# EAGLE design BluetoothJsoknitPIDv0.1 (EAGLE 6.1)
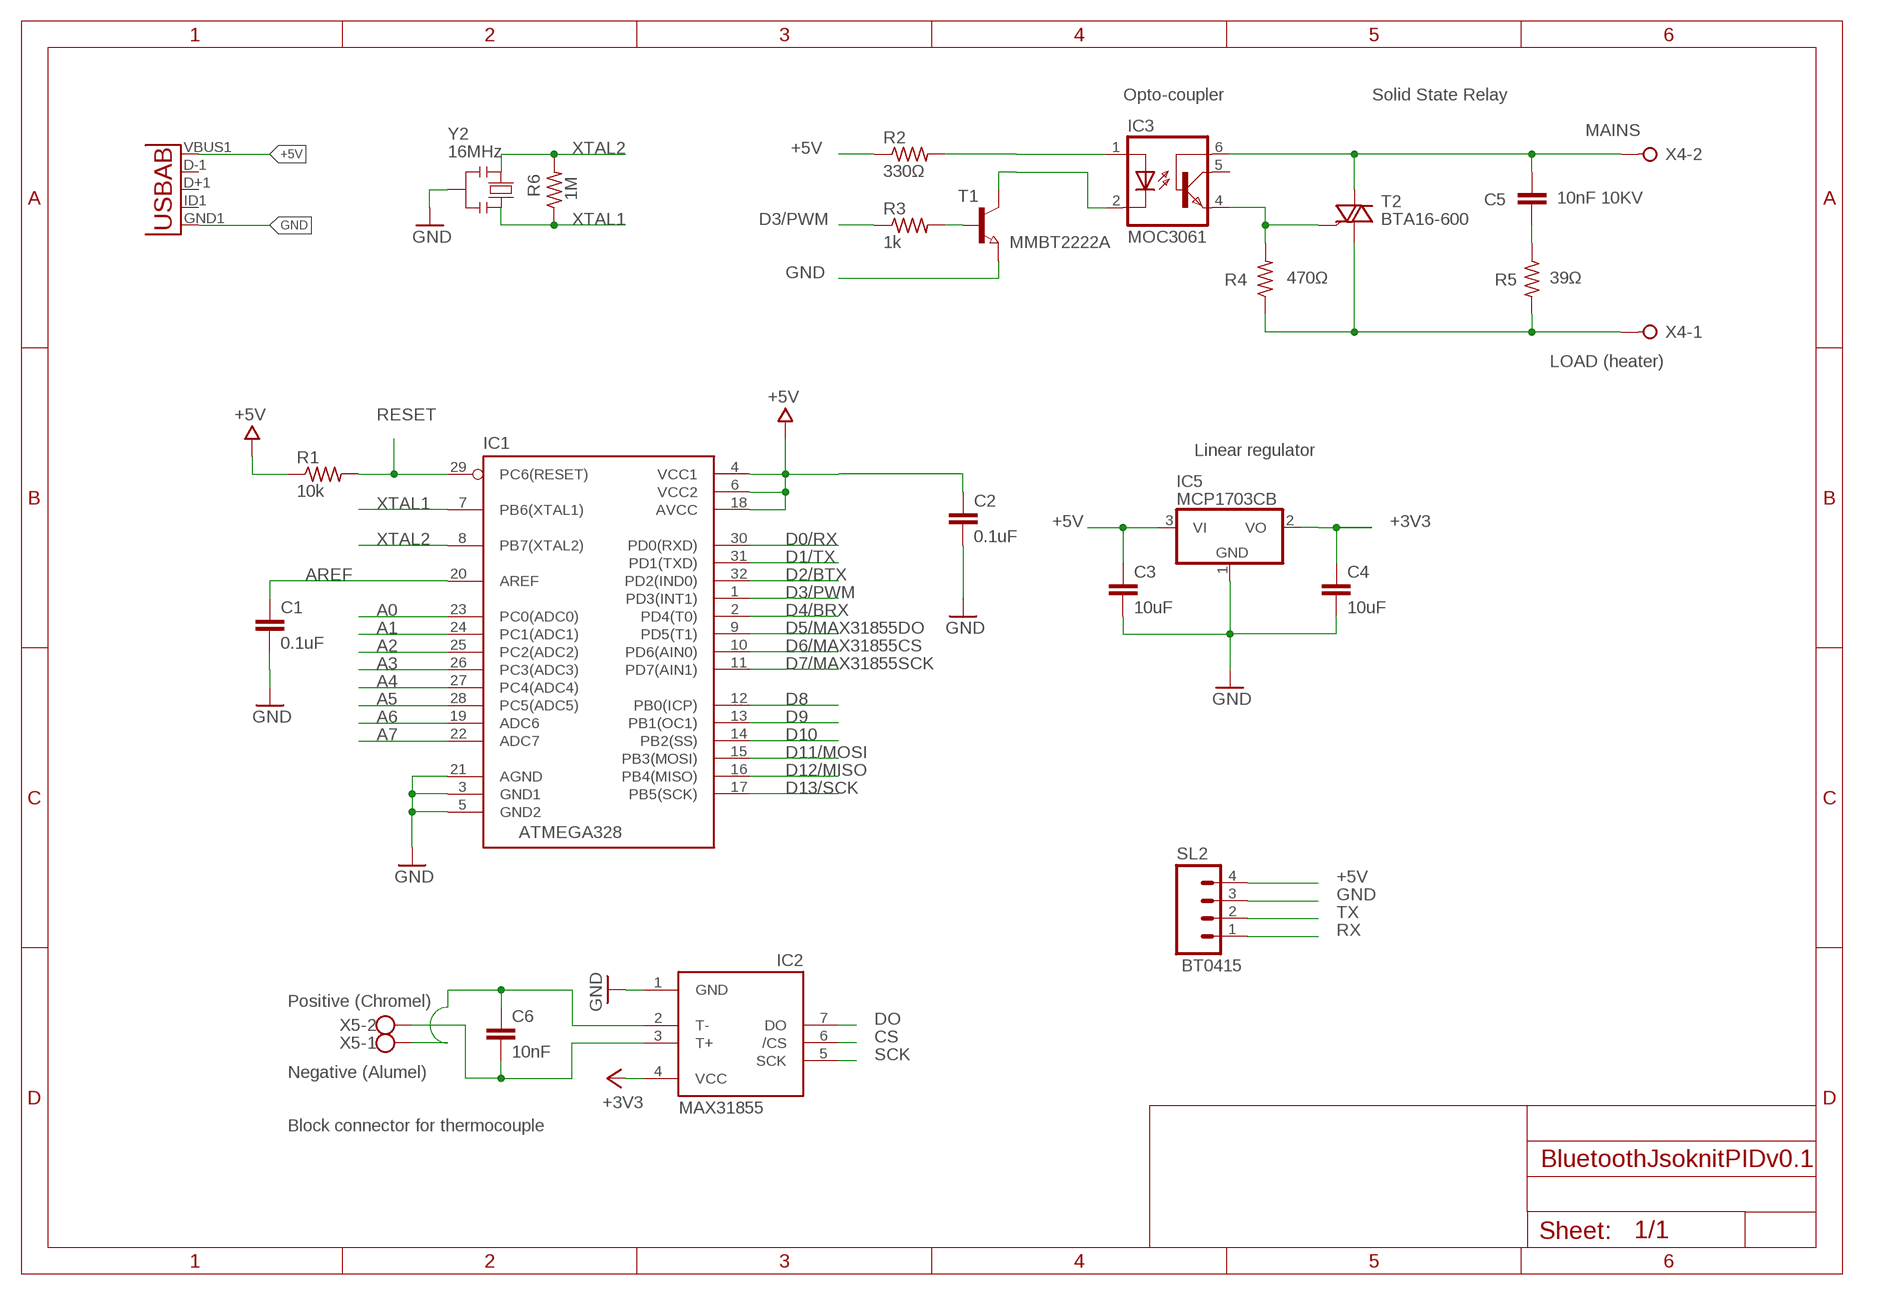
[diagram p0: schematic, sheet 1]

## Parts
C1  0.1uF  C-EUC0805  [C0805]
C2  0.1uF  C-EUC0805  [C0805]
C3  10uF  C-EUC0805  [C0805]
C4  10uF  C-EUC0805  [C0805]
C5  10nF 10KV  C-EU050-025X075  [C050-025X075]
C6  10nF  C-EUC0805  [C0805]
IC1  ATMEGA328  ATMEGA168-20AU  [QFP032]
IC2  MAX6675  [SO08]
IC3  MOC3061  4N25SM  [DIL6-SMD]
IC5  MCP1703CB  [SOT23]
R1  10k  R-US_M0805  [M0805]
R2  330Ω  R-US_M0805  [M0805]
R3  1k  R-US_M0805  [M0805]
R4  470Ω  R-US_0207/10  [0207/10]
R5  39Ω  R-US_0207/10  [0207/10]
R6  1M  R-US_M0805  [M0805]
SL2  BT0415  M04  [04P]
T1  MMBT2222A  NPN-TRANSISTOR_SOT23  [SOT23]
T2  BTA16-600  BT138-V  [TO220BV]
U$4  USB-AB""  [USB-AB-MICRO-SMD_V02_BOSS]
X4  W237-02P  [W237-132]
X5  W237-102  [W237-102]
Y2  16MHz  RESONATORMU  [RESONATOR]

## Nets
+3V3: C4.1 IC2.4(VCC) IC5.2(VO)
+5V: C2.1 C3.1 IC1.4(VCC1) IC1.6(VCC2) IC1.18(AVCC) IC5.3(VI) R1.1 R2.1 SL2.4 U$4.VBUS1(VBUS)
A0: IC1.23(PC0(ADC0))
A1: IC1.24(PC1(ADC1))
A2: IC1.25(PC2(ADC2))
A3: IC1.26(PC3(ADC3))
A4: IC1.27(PC4(ADC4))
A5: IC1.28(PC5(ADC5))
A6: IC1.19(ADC6)
A7: IC1.22(ADC7)
AREF: C1.1 IC1.20(AREF)
D0/RX: IC1.30(PD0(RXD))
D1/TX: IC1.31(PD1(TXD))
D2/BTX: IC1.32(PD2(IND0)) SL2.2
D3/PWM: IC1.1(PD3(INT1)) R3.1
D4/BRX: IC1.2(PD4(T0)) SL2.1
D5/MAX31855DO: IC1.9(PD5(T1)) IC2.7(DO)
D6/MAX31855CS: IC1.10(PD6(AIN0)) IC2.6(/CS)
D7/MAX31855SCK: IC1.11(PD7(AIN1)) IC2.5(SCK)
D8: IC1.12(PB0(ICP))
D9: IC1.13(PB1(OC1))
D10: IC1.14(PB2(SS))
D11/MOSI: IC1.15(PB3(MOSI))
D12/MISO: IC1.16(PB4(MISO))
D13/SCK: IC1.17(PB5(SCK))
GND [Power]: C1.2 C2.2 C3.2 C4.2 IC1.3(GND1) IC1.5(GND2) IC1.21(AGND) IC2.1(GND) IC5.1(GND) SL2.3 T1.2(E) U$4.GND1(GND) Y2.2
LOAD [Power]: R4.1 R5.2 T2.T1(A1) X4.1
MAINS: C5.1 IC3.6(BAS) T2.T2(A2) X4.2
MOC3061PIN4: IC3.4(EMI) R4.2 T2.G
N$9: IC3.2(C) T1.3(C)
N$10: R3.2 T1.1(B)
N$11: IC3.1(A) R2.2
N$14: C5.2 R5.1
RESET: IC1.29(PC6(RESET)) R1.2
T+: C6.2 IC2.3(T+) X5.2
T-: C6.1 IC2.2(T-)
T-1: X5.1
XTAL1: IC1.7(PB6(XTAL1)) R6.1 Y2.3
XTAL2: IC1.8(PB7(XTAL2)) R6.2 Y2.1
Unconnected: IC3.5(COL) U$4.D+1(D+) U$4.D-1(D-) U$4.ID1(USBID)

## Notes on the sheet
- Opto-coupler | Solid State Relay
- MAINS
- +5V
- D3/PWM
- GND
- LOAD (heater)
- RESET
- Linear regulator
- XTAL1
- +5V | +3V3
- XTAL2
- +5V
- GND
- TX
- RX
- Positive (Chromel)
- DO
- CS
- SCK
- Negative (Alumel)
- MAX31855
- Block connector for thermocouple

## Library data of the parts
C1-C6 = rcl:C-EU: CAPACITOR, European symbol
IC1 = MySMD:ATMEGA168-20AU
IC2 = adafruit:MAX6675
IC3 = optocoupler:4N*?M: General Purpose 6-Pin Phototransistor Optocouplers Source: http://www.fairchildsemi.com/ds/4N/4N35-M.pdf; MF: FAIRCHILD SEMICONDUCTOR; MPN: 4N25SM; OC_FARNELL: 1021152; OC_NEWARK: 34C2020
IC5 = linear:MCP1703: 250 mA, 16V, Low Quiescent Current LDO Regulator Source: http://ww1.microchip.com/downloads/en/DeviceDoc/22049b.pdf
R1-R6 = rcl:R-US_: RESISTOR, American symbol
SL2 = con-amp-quick:M04: AMP QUICK CONNECTOR; OC_FARNELL: unknown; OC_NEWARK: unknown
T1 = semicon-smd-ipc:NPN-TRANSISTOR_: NPN TRANSISTOR
T2 = triac:BT138: TRIAC Source: http://www.semiconductors.philips.com BT138_SERIES_2.pdf
U$4 = Testing:USB-AB: This is a USB AB connector that is compatible with USB OTG. i.e. this connector can serve as a host or device
X4 = con-wago-508:W237-02P: WAGO SREW CLAMP; OC_FARNELL: unknown; OC_NEWARK: unknown
X5 = con-wago-500:W237-102: WAGO SCREW CLAMP; MPN: 237-102; OC_FARNELL: unknown; OC_NEWARK: 70K9898
Y2 = SmartPrj:RESONATOR

## Net classes
0 default: width 0.152 mm, clearance 0.152 mm
1 Power: width 0.406 mm, drill 0.61 mm, clearance 0.152 mm
2 gnd: width 0.203 mm, drill 0.559 mm, clearance 0.152 mm
3 usbvcc: width 0.203 mm, drill 0.61 mm, clearance 0.152 mm
4 aref: width 0.203 mm, drill 0.61 mm, clearance 0.152 mm

## Board
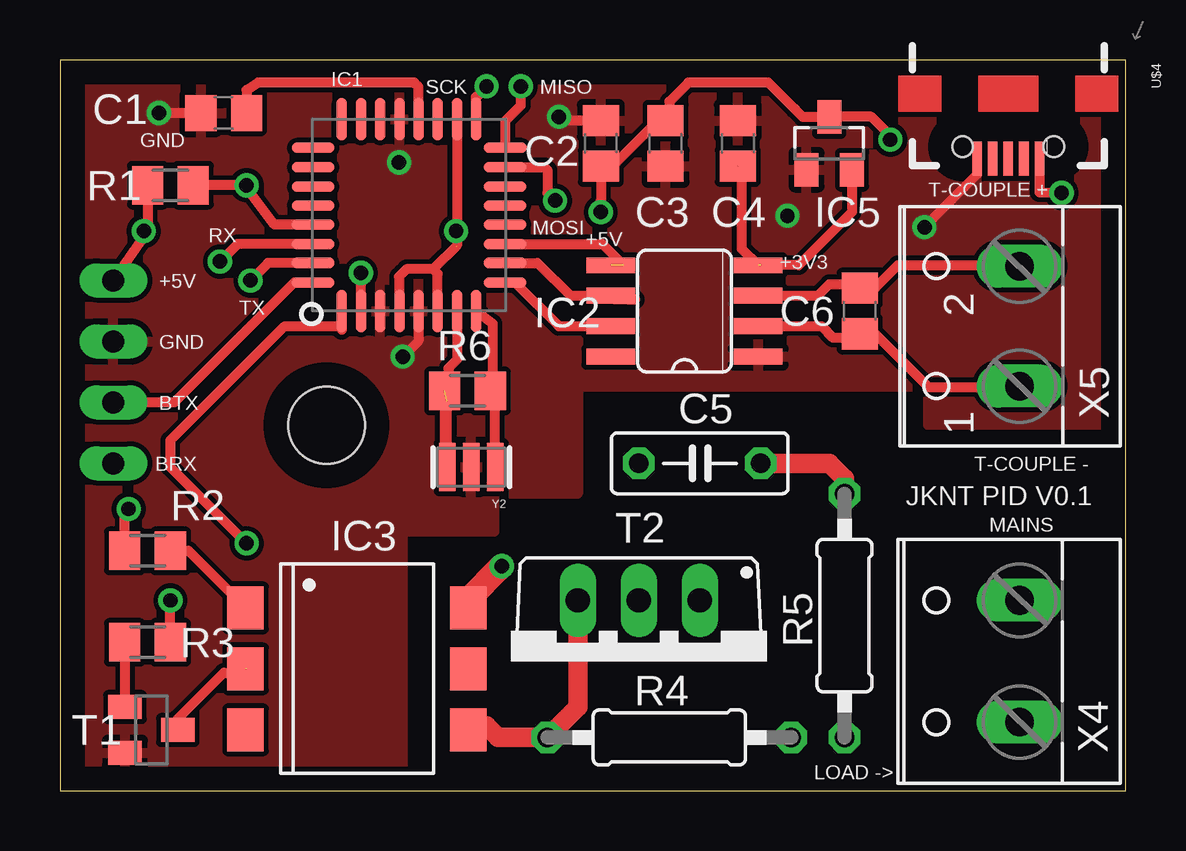
[diagram p1: board, top side]
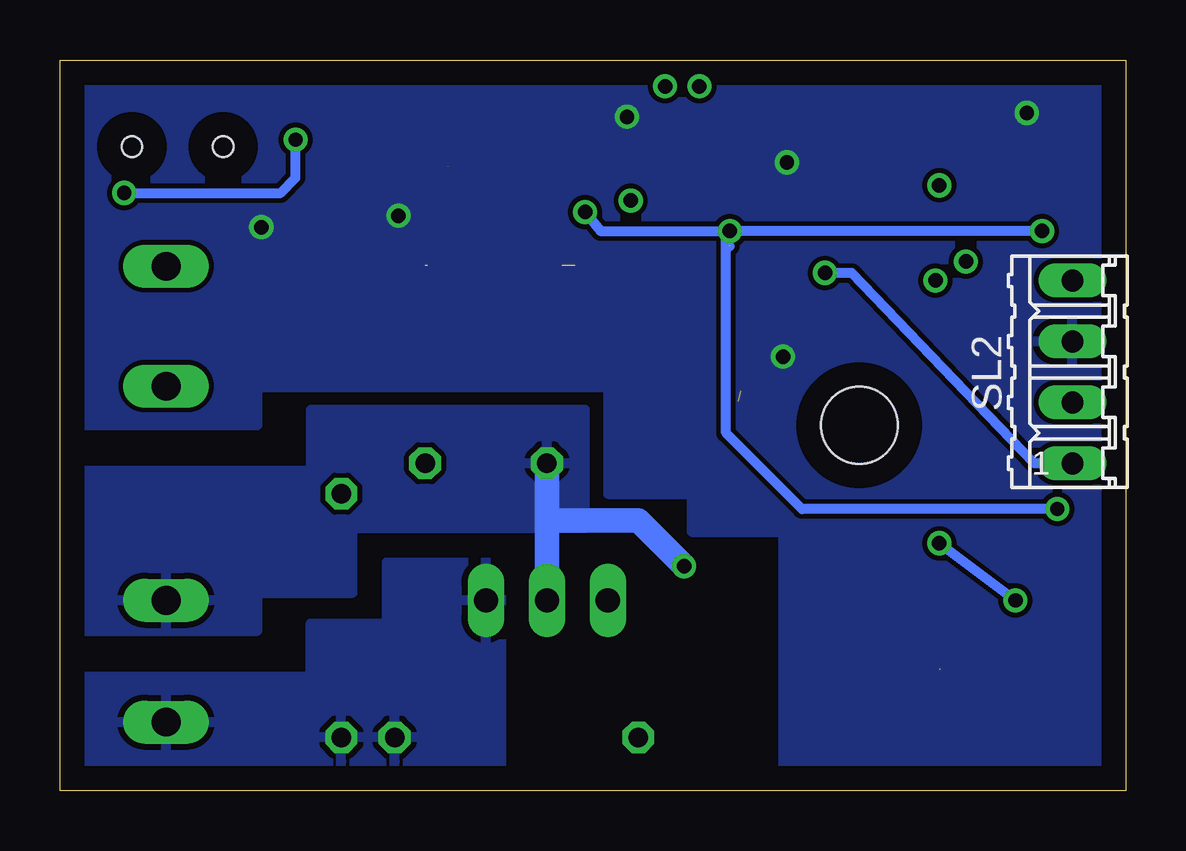
[diagram p2: board, bottom side, seen from below]

Size 44.43 x 30.47 mm. Coordinates in mm from the lower left corner, seen from the top.
Outline: 0,0 44.43,0 44.43,30.47 0,30.47 0,0
Copper layers (1*16): Top 0.035mm / dielectric 1.5mm / Bottom 0.035mm
Design rules: minimum track width 10mil, minimum drill 24mil, track to track 8mil, track to pad 8mil, pad to pad 8mil, via to via 8mil, smd to smd 8mil, copper to edge 40mil, drill to drill 8mil, minimum pad ring 10mil, minimum via ring 8mil, stop-mask expansion 4mil, vias tented up to drill 0mil, thermal gap 10mil
Holes 3.2 mm at 11.11,15.24

### Footprints (pad centres in the part's own frame; a part is rotated, then mirrored left to right if it is on the bottom)
C0805 = smd 1.3 x 1.5: 1 -0.95,0; 2 0.95,0
C050-025X075 = drill 0.813 octagon: 1 -2.54,0; 2 2.54,0
QFP032 = smd 0.432 x 1.778: 1 0,0; 2 0.8,0; 3 1.599,0; 4 2.399,0; 5 3.199,0; 6 3.998,0; 7 4.798,0; 8 5.598,0; 17 5.588,8.001; 18 4.798,7.997; 19 3.998,7.997; 20 3.199,7.997; 21 2.399,7.997; 22 1.599,7.997; 23 0.799,7.997; 24 0,7.997 | smd 1.778 x 0.432: 9 6.807,1.194; 10 6.807,2.007; 11 6.807,2.794; 12 6.807,3.607; 13 6.807,4.394; 14 6.807,5.182; 15 6.807,5.994; 16 6.816,6.803; 25 -1.194,6.807; 26 -1.194,5.994; 27 -1.194,5.182; 28 -1.194,4.394; 29 -1.194,3.607; 30 -1.194,2.794; 31 -1.194,2.007; 32 -1.194,1.194
SO08 = smd 0.66 x 2.032: 1 -1.905,-3.073; 2 -0.635,-3.073; 3 0.635,-3.073; 4 1.905,-3.073; 5 1.905,3.073; 6 0.635,3.073; 7 -0.635,3.073; 8 -1.905,3.073
DIL6-SMD = smd 1.78 x 1.52: 1 -2.54,-4.645; 2 0,-4.645; 3 2.54,-4.645; 4 2.54,4.645; 5 0,4.645; 6 -2.54,4.645
SOT23 = smd 1 x 1.4: 1 -0.95,-1.1; 2 0.95,-1.1; 3 0,1.1
M0805 = smd 1.3 x 1.6: 1 -0.95,0; 2 0.95,0
0207/10 = drill 0.813 octagon: 1 -5.08,0; 2 5.08,0
04P = drill 0.914 long: 1 -3.81,0; 2 -1.27,0; 3 1.27,0; 4 3.81,0
TO220BV = drill 1.016 long: G 2.54,-2.54; T1 -2.54,-2.54; T2 0,-2.54
USB-AB-MICRO-SMD_V02_BOSS = smd 1.4 x 0.4: D+1 2.7,0; D-1 2.7,0.65; GND1 2.7,-1.3; ID1 2.7,-0.65; VBUS1 2.7,1.3 | hole 0.85: 2.2,1.9; 2.2,-1.9
W237-132 = drill 1.194 long: 1 -2.54,-0.635; 2 2.54,-0.635
W237-102 = drill 1.194 long: 1 -2.5,-1.27; 2 2.5,-1.27
RESONATOR = smd 0.7 x 2: 1 -1,0; 2 0,0; 3 1,0

### Placement (x,y rotation side)
C1  6.83,28.26 180 top
C2  22.54,26.99 90 top
C3  25.24,26.99 270 top
C4  28.26,26.99 90 top
C5  26.67,13.65 0 top
C6  33.34,20 90 top
IC1  11.75,20 0 top
IC2  26.04,20 90 top
IC3  12.38,5.08 270 top
IC5  32.07,26.99 0 top
R1  4.6,25.24 0 top
R2  3.65,10 0 top
R3  3.65,6.19 180 top
R4  25.4,2.22 180 top
R5  32.7,7.3 270 top
R6  16.99,16.67 0 top
SL2  2.22,17.46 90 bottom
T1  3.81,2.54 270 top
T2  24.13,5.4 180 top
U$4  39.53,29.05 270 top
X4  39.37,5.4 90 top
X5  38.73,19.37 90 top
Y2  17.14,13.49 180 top

### Tracks (layer width: path | path; a pad name or v marks a point on that pad's centre or on a via)
+3V3  (2 unrouted)
  Top 0.406: C4.1 28.26,25.88 28.42,25.72 28.42,22.6 IC2.4 | IC5.2 33.02,24.13 30.8,21.91 29.21,21.91
+5V  (via drill 0.6)  (1 unrouted)
  Top 0.406: IC1.6 15.75,21.56 15.56,21.75 | 15.56,21.75 14.45,21.75 14.29,21.59 14.13,21.43 14.13,20.02 IC1.4 | U$4.VBUS1 40.83,24.95 v41.75,24.92 | v34.61,27.15 34.61,27.3 33.81,28.1 IC5.3 30.97,28.09 30.64,28.42 29.53,29.53 26.19,29.53 25.4,28.73 25.4,28.1 C3.1 24.93,27.62 24.61,27.62 23.02,26.04 C2.1 22.55,24.6 v22.54,24.13 | IC1.18 16.55,22.74 15.56,21.75 | R1.1 3.65,23.34 | 3.65,23.34 v3.49,23.34 | 3.65,23.34 SL2.4 | R2.1 2.7,11.59 v2.86,11.75
  Bottom 0.406: v41.75,24.92 35.24,24.92 34.61,25.56 v34.61,27.15 | v3.49,23.34 v16.51,23.34 | v2.86,11.75 13.49,11.75 16.67,14.92 16.67,23.18 | 16.67,23.18 v16.51,23.34 | v22.54,24.13 21.91,23.34 v16.51,23.34 | 16.67,23.18 16.67,22.86 16.51,22.7
AREF
  Top 0.406: IC1.20 14.95,29.34 14.76,29.53 8.26,29.53 7.78,29.21 7.78,28.1 C1.1
D0/RX  (via drill 0.6)
  Top 0.406: IC1.30 7.4,22.8 v6.67,22.07
D1/TX  (via drill 0.6)
  Top 0.406: IC1.31 8.67,22.01 v7.94,21.27
D2/BTX
  Top 0.406: IC1.32 9.77,21.2 4.76,16.19 SL2.2
D3/PWM  (via drill 0.6)
  Top 0.406: IC1.1 11.75,19.37 | 11.75,19.37 11.75,19.21 | R3.1 v4.6,7.93 v4.6,7.94 | 11.75,19.37 9.37,19.37 4.6,14.61 4.6,13.49 v7.78,10.32
  Bottom 0.406: v4.6,7.94 v7.78,10.32
D4/BRX  (via drill 0.6)
  Top 0.406: IC1.2 v12.55,21.58 v12.54,21.59
  Bottom 0.406: SL2.1 3.81,13.65 11.43,21.59 v12.54,21.59
D5/MAX31855DO
  Top 0.406: IC1.9 18.97,21.2 20.8,19.37 IC2.7
D6/MAX31855CS
  Top 0.406: IC1.10 19.9,22.01 21.27,20.64 IC2.6 | IC2.6 23.5,20.64 23.65,20.48 23.97,20.48 23.12,20.48 IC2.6
D7/MAX31855SCK  (1 unrouted)
  Top 0.406: IC1.11 22.61,22.8 23.5,21.91
D11/MOSI  (via drill 0.6)
  Top 0.406: IC1.15 20.2,26 20.32,25.88 20.32,24.92 v20.64,24.61
D12/MISO  (via drill 0.6)
  Top 0.406: IC1.16 18.56,27.93 19.21,28.57 v19.21,29.37
D13/SCK  (via drill 0.6)
  Top 0.406: IC1.17 17.34,28.92 v17.78,29.37
GND  (via drill 0.6)
  Top 0.406: U$4.GND1 38.23,25.69 v36.04,23.5 | C1.2 v4.13,28.26 | IC1.5 14.95,18.76 v14.29,18.1 | C2.2 20.96,27.94 v20.8,28.1
  other vias: 30.32,23.97 14.13,26.19
  pour Bottom: 0,0 0,30.48 44.45,30.48 44.45,15.24 36.2,15.24 36.2,16.83 21.59,16.83 21.59,12.38 18.1,12.38 18.1,10.79 14.61,10.79 14.29,10.79 14.29,0
  pour Top: 0,0 0,30.48 44.45,30.48 44.45,15.24 36.2,15.24 36.2,16.83 21.59,16.83 21.59,12.38 18.1,12.38 18.1,10.79 14.29,10.79 14.29,0
LOAD
  pour Bottom: 26.04,9.53 26.04,0.64 43.81,0.64 44.13,0.64 44.13,4.76 33.97,4.76 33.97,6.99 31.11,6.99 30.8,6.99 30.8,9.53
MAINS  (via drill 0.6)
  Top 1.016: IC3.6 17.03,7.98 v18.41,9.37
  Bottom 1.016: C5.1 24.13,11.27 | 24.13,11.27 T2.T2 | v18.41,9.37 19.37,10.32 20.32,11.27 22.86,11.27 24.13,11.27
  pour Bottom: 43.81,6.67 36.2,6.67 36.2,8.26 32.23,8.26 32.23,10.95 22.54,10.95 22.54,15.88 33.97,15.88 33.97,13.34 43.81,13.34
MOC3061PIN4
  Top 0.406: 17.78,2.7 17.19,2.7 IC3.4
  Top 0.813: T2.G 21.59,3.49 R4.2 18.26,2.22 17.78,2.7
N$9  (1 unrouted)
  Top 0.406: T1.3 4.91,3 6.83,4.92 7.62,4.92 7.78,5.08
N$10
  Top 0.406: T1.1 R3.2
N$11
  Top 0.406: R2.2 5.36,10 IC3.1
N$14
  Top 0.813: R5.1 32.7,13.02 32.07,13.65 C5.2
RESET  (via drill 0.6)
  Top 0.406: IC1.29 8.93,23.61 7.94,24.92 | 7.94,24.92 v7.78,25.24 | v7.78,25.24 7.94,24.92 | v7.78,25.24 R1.2
T+
  Top 0.406: IC2.3 31.59,20.64 32.07,21.11 33.18,21.11 C6.2 33.97,20.95 34.92,21.91 39.97,21.91 X5.2
T-
  Top 0.406: IC2.2 31.75,19.37 32.23,18.89 33.49,18.89 C6.1 33.97,19.05 36.2,16.83 39.85,16.83 | 39.85,16.83 40.01,16.83 | 40.01,16.83 40.16,16.83 40.01,16.83 | 40.01,16.83 39.85,16.83 | 39.85,16.83 40.01,16.99 40.01,16.83
XTAL1  (1 unrouted)
  Top 0.406: 16.14,16.24 Y2.3 16.14,15.92 16.03,16.03 | IC1.7 16.55,17.97 16.54,17.97 16.19,17.62 16.19,16.19 16.03,16.19 16.03,16.03 | 16.03,16.03 16.03,13.65 16.19,13.49
XTAL2
  Top 0.406: Y2.1 18.14,16.24 17.94,16.45 R6.2 18.03,16.77 18.03,19.47 IC1.8

### Text on the board
_tsilk: SCK | MISO | GND | T-COUPLE + | RX | MOSI | +5V | +3V3 | +5V | TX | GND | BTX | BRX | T-COUPLE - | JKNT PID V0.1 | MAINS | LOAD ->